# Altium schematic sheet VerticalKeyStrip.SchDoc
size A
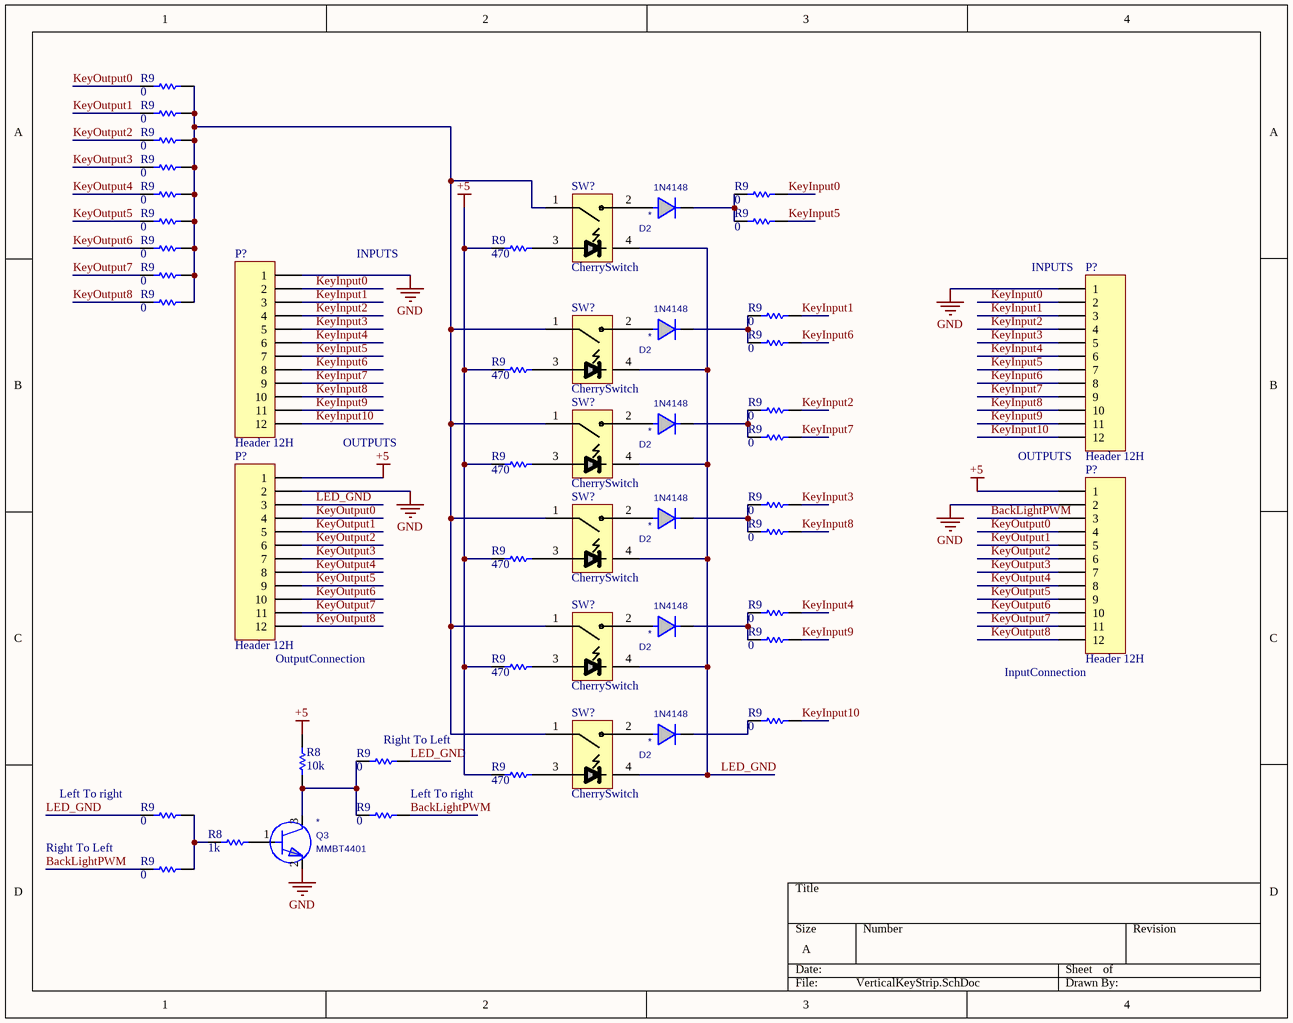
[diagram p0: VerticalKeyStrip.SchDoc]

## Parts
(Parts that share a designator on the sheet are numbered #1, #2 ... from top to bottom, then left to right.)
D2#1  1N4148  [DIODE400/60/32]
D2#2  1N4148  [DIODE400/60/32]
D2#3  1N4148  [DIODE400/60/32]
D2#4  1N4148  [DIODE400/60/32]
D2#5  1N4148  [DIODE400/60/32]
D2#6  1N4148  [DIODE400/60/32]
P?#1  Header 12H  [HDR1X12H]
P?#2  Header 12H  [HDR1X12H]
P?#3  Header 12H  [HDR1X12H]
P?#4  Header 12H  [HDR1X12H]
Q3  value MMBT4401  [SOT23-3]  (hidden comment: NPN_TRANSISTOR)
R8#1  value 10k  [RESC2012L]  (hidden comment: Res Semi)
R8#2  value 1k  [RESC2012L]  (hidden comment: Res Semi)
R9#1  value 0  [RESC2012L]  (hidden comment: Res Semi)
R9#2  value 0  [RESC2012L]  (hidden comment: Res Semi)
R9#3  value 0  [RESC2012L]  (hidden comment: Res Semi)
R9#4  value 0  [RESC2012L]  (hidden comment: Res Semi)
R9#5  value 0  [RESC2012L]  (hidden comment: Res Semi)
R9#6  value 0  [RESC2012L]  (hidden comment: Res Semi)
R9#7  value 0  [RESC2012L]  (hidden comment: Res Semi)
R9#8  value 0  [RESC2012L]  (hidden comment: Res Semi)
R9#9  value 0  [RESC2012L]  (hidden comment: Res Semi)
R9#10  value 470  [RESC2012L]  (hidden comment: Res Semi)
R9#11  value 0  [RESC2012L]  (hidden comment: Res Semi)
R9#12  value 0  [RESC2012L]  (hidden comment: Res Semi)
R9#13  value 0  [RESC2012L]  (hidden comment: Res Semi)
R9#14  value 0  [RESC2012L]  (hidden comment: Res Semi)
R9#15  value 470  [RESC2012L]  (hidden comment: Res Semi)
R9#16  value 0  [RESC2012L]  (hidden comment: Res Semi)
R9#17  value 0  [RESC2012L]  (hidden comment: Res Semi)
R9#18  value 470  [RESC2012L]  (hidden comment: Res Semi)
R9#19  value 0  [RESC2012L]  (hidden comment: Res Semi)
R9#20  value 0  [RESC2012L]  (hidden comment: Res Semi)
R9#21  value 470  [RESC2012L]  (hidden comment: Res Semi)
R9#22  value 0  [RESC2012L]  (hidden comment: Res Semi)
R9#23  value 0  [RESC2012L]  (hidden comment: Res Semi)
R9#24  value 470  [RESC2012L]  (hidden comment: Res Semi)
R9#25  value 0  [RESC2012L]  (hidden comment: Res Semi)
R9#26  value 0  [RESC2012L]  (hidden comment: Res Semi)
R9#27  value 470  [RESC2012L]  (hidden comment: Res Semi)
R9#28  value 0  [RESC2012L]  (hidden comment: Res Semi)
R9#29  value 0  [RESC2012L]  (hidden comment: Res Semi)
R9#30  value 0  [RESC2012L]  (hidden comment: Res Semi)
SW?#1  CherrySwitch  [CherryMxSwitch]
SW?#2  CherrySwitch  [CherryMxSwitch]
SW?#3  CherrySwitch  [CherryMxSwitch]
SW?#4  CherrySwitch  [CherryMxSwitch]
SW?#5  CherrySwitch  [CherryMxSwitch]
SW?#6  CherrySwitch  [CherryMxSwitch]

## Nets
+5: P?#3.1 P?#4.1 R8#1.2 R9#10.1 R9#15.1 R9#18.1 R9#21.1 R9#24.1 R9#27.1
GND: P?#1.1 P?#2.1 P?#3.2 P?#4.2 Q3.2(emitter)
BackLightPWM: P?#4.3 R9#29.2 R9#30.1
KeyInput0: P?#1.2 P?#2.2 R9#6.2
KeyInput1: P?#1.3 P?#2.3 R9#13.2
KeyInput2: P?#1.4 P?#2.4 R9#16.2
KeyInput3: P?#1.5 P?#2.5 R9#19.2
KeyInput4: P?#1.6 P?#2.6 R9#22.2
KeyInput5: P?#1.7 P?#2.7 R9#8.2
KeyInput6: P?#1.8 P?#2.8 R9#14.2
KeyInput7: P?#1.9 P?#2.9 R9#17.2
KeyInput8: P?#1.10 P?#2.10 R9#20.2
KeyInput9: P?#1.11 P?#2.11 R9#23.2
KeyInput10: P?#1.12 P?#2.12 R9#25.2
KeyOutput0: P?#3.4 P?#4.4 R9#1.1
KeyOutput1: P?#3.5 P?#4.5 R9#2.1
KeyOutput2: P?#3.6 P?#4.6 R9#3.1
KeyOutput3: P?#3.7 P?#4.7 R9#4.1
KeyOutput4: P?#3.8 P?#4.8 R9#5.1
KeyOutput5: P?#3.9 P?#4.9 R9#7.1
KeyOutput6: P?#3.10 P?#4.10 R9#9.1
KeyOutput7: P?#3.11 P?#4.11 R9#11.1
KeyOutput8: P?#3.12 P?#4.12 R9#12.1
LED_GND: P?#3.3 R9#26.2 R9#28.1 SW?#1.4 SW?#2.4 SW?#3.4 SW?#4.4 SW?#5.4 SW?#6.4
NetD2#1_1: D2#1.1(CATHODE) R9#6.1 R9#8.1
NetD2#1_2: D2#1.2(ANODE) SW?#1.2
NetD2#2_1: D2#2.1(CATHODE) R9#13.1 R9#14.1
NetD2#2_2: D2#2.2(ANODE) SW?#2.2
NetD2#3_1: D2#3.1(CATHODE) R9#16.1 R9#17.1
NetD2#3_2: D2#3.2(ANODE) SW?#3.2
NetD2#4_1: D2#4.1(CATHODE) R9#19.1 R9#20.1
NetD2#4_2: D2#4.2(ANODE) SW?#4.2
NetD2#5_1: D2#5.1(CATHODE) R9#22.1 R9#23.1
NetD2#5_2: D2#5.2(ANODE) SW?#5.2
NetD2#6_1: D2#6.1(CATHODE) R9#25.1
NetD2#6_2: D2#6.2(ANODE) SW?#6.2
NetQ3_1: Q3.1(base) R8#2.2
NetQ3_3: Q3.3(collector) R8#1.1 R9#26.1 R9#29.1
NetR8#2_1: R8#2.1 R9#28.2 R9#30.2
NetR9#1_2: R9#1.2 R9#2.2 R9#3.2 R9#4.2 R9#5.2 R9#7.2 R9#9.2 R9#11.2 R9#12.2 SW?#1.1 SW?#2.1 SW?#3.1 SW?#4.1 SW?#5.1 SW?#6.1
NetR9#10_2: R9#10.2 SW?#1.3
NetR9#15_2: R9#15.2 SW?#2.3
NetR9#18_2: R9#18.2 SW?#3.3
NetR9#21_2: R9#21.2 SW?#4.3
NetR9#24_2: R9#24.2 SW?#5.3
NetR9#27_2: R9#27.2 SW?#6.3

## Notes on the sheet
- INPUTS
- (near P?#2) INPUTS
- OUTPUTS
- (near P?#2) OUTPUTS
- (near P?#3) OutputConnection
- (near P?#4) InputConnection
- (near R9#26) Right To Left
- (near R9#28) Left To right
- (near R9#29) Left To right
- (near R9#30) Right To Left

## Library data of the parts
D2#1-D2#6 = 5283: Diode, 1N4148, 75V, 0.4 in., DO-35, 150mA, Switching, 500mW, Any; LeadSpacing: 0.4 in.; Reference: g:\accel_lib\datasheets\1N914-916-4148-Fairchild.PDF; plIDX: 5283; DNS: *; Value: 1N4148; Package: DO-35; Wattage: 500mW; Vendor: Any; DiodeType: Switching; Voltage: 75V; Amperage: 150mA; CheckedBy: B. Lyon; ModifyDate: 08/27/2007 16:11:30; ComponentType: Diode; Cost: 0.0038; ComponentLink4URL: https://pdm.iconfitness.com/PDM/EBOM/PartsMaintenance/PartsMaintenance.aspx?Editplidx=5283; ComponentLink4Description: PDM Parts Maintenance
P?#1-P?#4 = Header 12H: Header, 12-Pin, Right Angle; LatestRevisionDate: 17-Jul-2002; LatestRevisionNote: Re-released for DXP Platform.; Publisher: Altium Limited
Q3 = 265442: Transistor, MMBT4401, 40V, SOT23-3, 500mA, NPN, Transistor, On Semi: MMBT4401LT1; plIDX: 265442; CheckedBy: gdeguzman; DNS: *; ComponentType: Transistor; CreatedBy: Mike Tyger; LastUpdatedBy: Mike Tyger; Cost: 0.0094; Voltage: 40V; Package: SOT23-3; Amperage: 500mA; TransistorType: NPN; ChipType: Transistor; Vendor: On Semi: MMBT4401LT1; ComponentLink4URL: https://pdm.iconfitness.com/PDM/EBOM/PartsMaintenance/PartsMaintenance.aspx?Editplidx=265442; ComponentLink4Description: PDM Parts Maintenance
R8#1 R8#2 R9#1-R9#30 = Res Semi: Semiconductor Resistor; Published: 8-Jun-2000; LatestRevisionDate: 17-Jul-2002; LatestRevisionNote: Re-released for DXP Platform.; PackageReference: AXIAL-0.5; Publisher: Altium Limited
SW?#1-SW?#6 = CherrySwitch: Cherry MX Switch layout